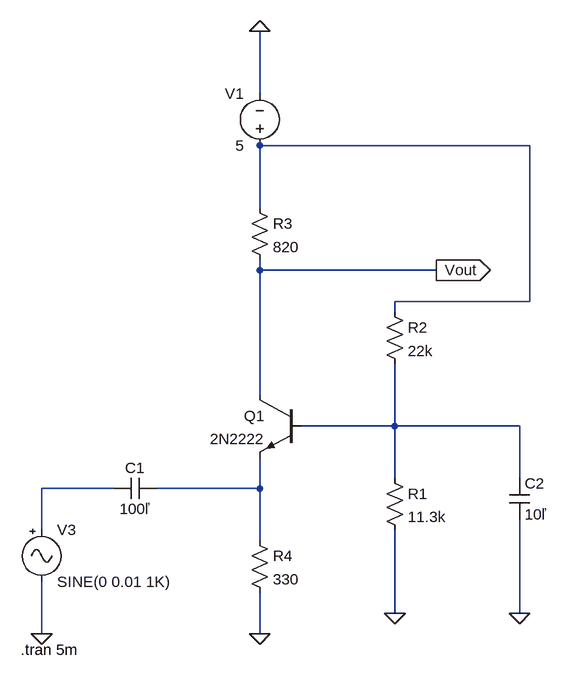
[diagram p0: schematic CB Stage.asc]
CB Stage.asc, the LTspice schematic file:
Version 4.1
SHEET 1 880 680
WIRE -736 -656 -736 -752
WIRE -320 -576 -736 -576
WIRE -736 -480 -736 -576
WIRE -736 -384 -736 -400
WIRE -464 -384 -736 -384
WIRE -320 -336 -320 -576
WIRE -320 -336 -528 -336
WIRE -528 -320 -528 -336
WIRE -736 -192 -736 -384
WIRE -528 -144 -528 -240
WIRE -528 -144 -672 -144
WIRE -336 -144 -528 -144
WIRE -528 -64 -528 -144
WIRE -336 -64 -336 -144
WIRE -960 -48 -1072 -48
WIRE -736 -48 -736 -96
WIRE -736 -48 -896 -48
WIRE -1072 16 -1072 -48
WIRE -736 32 -736 -48
WIRE -528 144 -528 16
WIRE -336 144 -336 0
WIRE -1072 176 -1072 96
WIRE -736 176 -736 112
FLAG -1072 176 0
FLAG -736 -752 0
FLAG -464 -384 Vout
IOPIN -464 -384 Out
FLAG -528 144 0
FLAG -336 144 0
FLAG -736 176 0
SYMBOL npn -672 -192 M0
SYMATTR InstName Q1
SYMATTR Value 2N2222
SYMBOL Misc\\signal -1072 0 R0
WINDOW 123 0 0 Left 0
WINDOW 39 0 0 Left 0
SYMATTR InstName V3
SYMATTR Value SINE(0 0.01 1K)
SYMBOL res -544 -80 R0
SYMATTR InstName R1
SYMATTR Value 11.3k
SYMBOL res -544 -336 R0
SYMATTR InstName R2
SYMATTR Value 22k
SYMBOL res -752 -496 R0
SYMATTR InstName R3
SYMATTR Value 820
SYMBOL voltage -736 -560 R180
WINDOW 0 24 96 Left 2
WINDOW 3 24 16 Left 2
SYMATTR InstName V1
SYMATTR Value 5
SYMBOL cap -352 -64 R0
SYMATTR InstName C2
SYMATTR Value 10ľ
SYMBOL res -752 16 R0
SYMATTR InstName R4
SYMATTR Value 330
SYMBOL cap -896 -64 R90
WINDOW 0 0 32 VBottom 2
WINDOW 3 32 32 VTop 2
SYMATTR InstName C1
SYMATTR Value 100ľ
TEXT -1104 200 Left 2 !.tran 5m

The netlist it stands for:
* CB Stage.asc
Q1 Vout N002 N004 0 2N2222
V3 N003 0 SINE(0 0.01 1K)
R1 N002 0 11.3k
R2 N001 N002 22k
R3 N001 Vout 820
V1 N001 0 5
C2 N002 0 10ľ
R4 N004 0 330
C1 N004 N003 100ľ
.model NPN NPN
.model PNP PNP
.lib standard.bjt
.tran 5m
.backanno
.end